# EasyEDA Pro project ProProject_Stc32f_Car副本_2024-06-03.epro, schematic schematic4_1
Create Date: 2024-03-14; Page Name: P1; Project Name: STC32F主板; Schematic Name: Schematic4; Update Date: 2024-04-30; Company: 嘉立创EDA; Page Size: A4; Version: V1.0
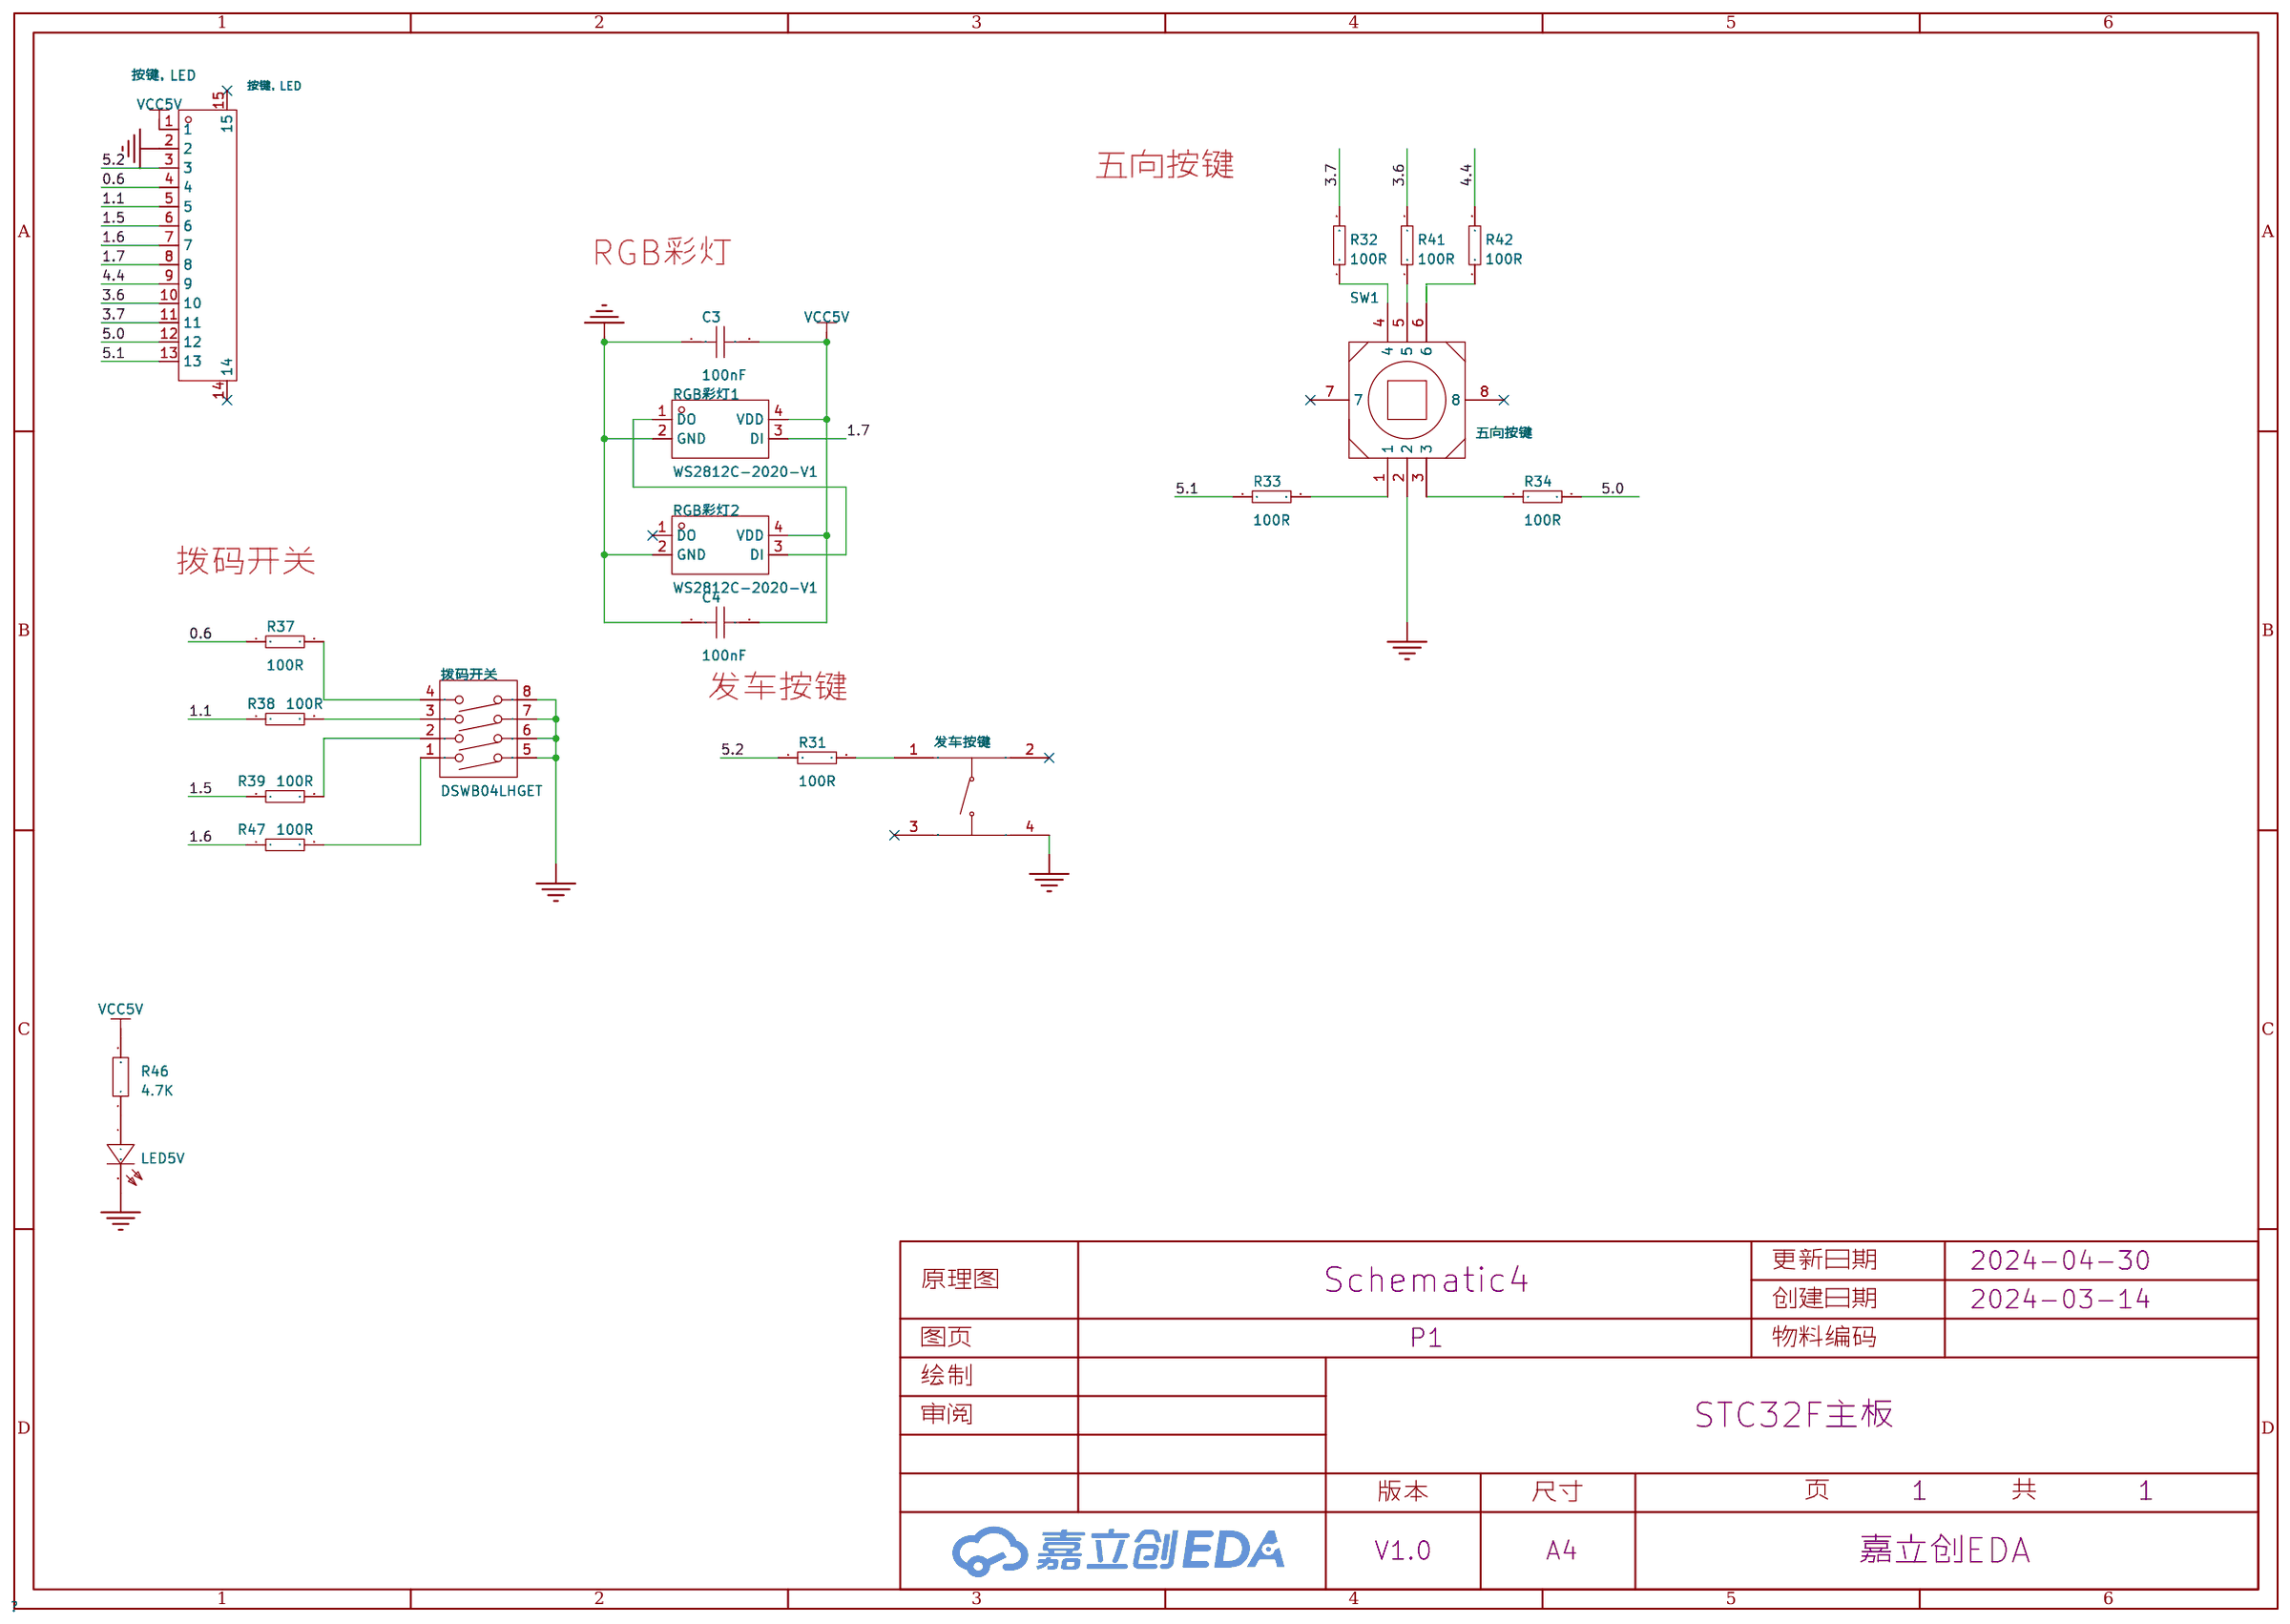
[diagram p2: schematic sheet]

## Parts
C3  100nF  [C0603]
C4  100nF  [C0603]
LED5V  翠绿贴片LED  [LEDC1608(0603)-L]
R31  100R  [RESC1608[0603]S-N]
R32  100R  [RESC1608[0603]S-N]
R33  100R  [RESC1608[0603]S-N]
R34  100R  [RESC1608[0603]S-N]
R37  100R  [RESC1608[0603]S-N]
R38  100R  [RESC1608[0603]S-N]
R39  100R  [RESC1608[0603]S-N]
R41  100R  [RESC1608[0603]S-N]
R42  100R  [RESC1608[0603]S-N]
R46  4.7K  [R0603]
R47  100R  [RESC1608[0603]S-N]
RGB彩灯1  WS2812C-2020-V1  [LED-SMD_4P-L2.0-W2.0-TL_WS2812B-2020]
RGB彩灯2  WS2812C-2020-V1  [LED-SMD_4P-L2.0-W2.0-TL_WS2812B-2020]
SW1  五向按键  [SW-SMD_GT-TC0060-H050-L1]
发车按键  TS3425PA 250gf 098  [SW-SMD_4P-L4.2-W3.4-P2.15-LS5.2]
拨码开关  DSWB04LHGET  [SW-TH_DSWB04LHGET]
按键，LED  按键，LED  [FPC-SMD_13P-P0.50_AFD01-S13FCA--00]

## Library data of the parts
C3 C4 = CAP_0603: Supplier Footprint: 0603
LED5V = LED Chip Green: Published: 8-Jun-2000; Revision: July-2002: Re-released for DXP Platform.; Publisher: Altium Limited; Price(RMB): 0.00; Origin Footprint 2: LEDC1608(0603); Origin Footprint 3: LEDC2012(0805); Origin Footprint 4: LEDC3216(1206); Origin Footprint 5: LEDC2012(0805)-L; Origin Footprint 6: LEDC3216(1204); Origin Footprint 7: LEDC3528-2
R31-R34 R37-R39 R41 R42 R47 = Res-Chip_9: Revision: V1.0; Power: 1/8W; Tolerance: ±1%; Origin Footprint 2: RESC0603[0201]-L; Origin Footprint 3: RESC0603[0201]-M; Origin Footprint 4: RESC0603[0201]-N; Origin Footprint 5: RESC0603[0201]S-L; Origin Footprint 6: RESC0603[0201]S-M; Origin Footprint 7: RESC0603[0201]S-N; Origin Footprint 8: RESC1005[0402]-L; Origin Footprint 9: RESC1005[0402]S-M; Origin Footprint 10: RESC1005[0402]-M; Origin Footprint 11: RESC1005[0402]-N; Origin Footprint 12: RESC1005[0402]S-L; Origin Footprint 13: RESC1005[0402]S-N; Origin Footprint 14: RESC1608[0603]-L; Origin Footprint 15: RESC1608[0603]-M; Origin Footprint 16: RESC1608[0603]-N; Origin Footprint 17: RESC1608[0603]S-L; Origin Footprint 18: RESC1608[0603]S-M; Origin Footprint 19: RESC2012[0805]; Origin Footprint 20: RESC2012[0805]S-L; Origin Footprint 21: RESC2012[0805]S-M; Origin Footprint 22: RESC2012[0805]S-N; Origin Footprint 23: RESC3216[1206]; Origin Footprint 24: RESC3216[1206]S-L; Origin Footprint 25: RESC3216[1206]S-M; Origin Footprint 26: RESC3216[1206]S-N; Origin Footprint 27: RESC3225[1210]; Origin Footprint 28: RESC3225[1210]S; Origin Footprint 29: RESC5025[2010]; Origin Footprint 30: RESC5025[2010]S; Origin Footprint 31: RESC6332[2512]; Origin Footprint 32: RESC6332[2512]S
R46 = Res_0603: Supplier Footprint: 0603
RGB彩灯1 RGB彩灯2 = WS2812C-2020-V1: 发光颜色:RGB三色;功率:-;正向电流:-;主波长:624nm；520nm；467nm;二极管配置:-;透镜颜色:-;色温:-;发光角度:-;载带方式:-;工作温度:-;; LCSC Part Name: RGB三色; Supplier Part: C2976072; Manufacturer: worldsemi; Supplier Footprint: SMD,2x2mm; JLCPCB Part Class: 扩展库; Datasheet: https://atta.szlcsc.com/upload/public/pdf/source/20220222/52A01000447F5320C9A8C3F34CEFDB81.pdf; Supplier: LCSC; Emitted Color: RGB三色; Dominant Wavelength: 624nm；520nm；467nm
SW1 = GT-TC0060-H050-L1: 开关长度:7.5mm;开关宽度:7.5mm;开关高度:5mm;机械寿命:-;; LCSC Part Name: 斜五向轻触开关 H5.0mm 无按压; Supplier Part: C3019726; Manufacturer: G-Switch(品赞); Supplier Footprint: SMD; JLCPCB Part Class: Extended Part; Datasheet: https://atta.szlcsc.com/upload/public/pdf/source/20220627/F366006EF64285B0201E3F28D953CABE.pdf; Supplier: LCSC; Switch Length: 7.5mm; Switch Width: 7.5mm; Switch Height: 5mm
发车按键 = TS3425PA 250gf 098: 电路结构:单刀单掷;按钮形状:椭圆形按钮;作用力:160gf;安装方式:立贴;开关长度:4mm;开关宽度:3mm;开关高度:2.5mm;带支架:不带;触点电流:50mA;额定电压(DC):12V;额定功率:0.6W;绝缘电阻:100MΩ;带灯:无;机械寿命:10万次;; LCSC Part Name: 电子烟轻触开关3*4*2.5mm 平脚3.4*4.2*2.5mm  250gf; Supplier Part: C5363474; Manufacturer: SHOU HAN(首韩); Supplier Footprint: SMD; JLCPCB Part Class: 扩展库; Datasheet: https://atta.szlcsc.com/upload/public/pdf/source/20230224/8E2DED868FB52CBA25EDBDE418AA439A.pdf; Supplier: LCSC; Circuit: 单刀单掷; Actuator Style: 椭圆形按钮; Operating Force: 160gf; Mounting Style: 立贴; Switch Length: 4mm; Switch Width: 3mm; Switch Height: 2.5mm; Strike Gundam: 不带; Contact Current: 50mA; Voltage Rating (DC): 12V; Power Rating: 0.6W; Insulation Resistance: 100MΩ; Actuator/Cap Color: 白色; With Lamp: 无; Mechanical Life: 10万次; Operating Temperature: -20℃~+80℃
拨码开关 = DSWB04LHGET: 类型:平拨,凸起式;电路结构:单刀单掷;开关位数:4位;使用寿命:-;颜色:红色;; LCSC Part Name: 间距2.54mm 平拨,凸起式 4位拨码开关; Supplier Part: C99418; Manufacturer: YE; Supplier Footprint: 插件; JLCPCB Part Class: 扩展库; Datasheet: https://atta.szlcsc.com/upload/public/pdf/source/20220830/02827E67A8727938D957A3CE4C86C92D.pdf; Supplier: LCSC; Type: 平拨,凸起式; Circuit: 单刀单掷; Number of Positions: 4位; Lead Pitch: 2.54mm; Color: 红色
按键，LED = AFD01-S13FCC-00: 锁定特性:翻盖式;触点类型:下接;触点数量:13P;间距:0.5mm;安装类型:卧贴;; LCSC Part Name: 间距:0.5mm P数:13P 翻盖式 下接; Supplier Part: C18198486; Manufacturer: JS(钜硕电子); Supplier Footprint: SMD,P=0.5mm,卧贴; Datasheet: https://atta.szlcsc.com/upload/public/pdf/source/20230921/C984413AEFF3A883511B509B58F9A1F7.pdf; Supplier: LCSC; Locking Feature: 翻盖式; Contact Type: 下接; Number of Contacts: 13P; Pitch: 0.5mm; Mounting Type: 卧贴; Height Above Board: 2mm

## Nets
GND: C3.1 C4.1 LED5V.C RGB彩灯1.2(GND) RGB彩灯2.2(GND) SW1.2 发车按键.4 拨码开关.5 拨码开关.6 拨码开关.7 拨码开关.8 按键，LED.2
VCC5V: C3.2 C4.2 R46.2 RGB彩灯1.4(VDD) RGB彩灯2.4(VDD) 按键，LED.1
0.6: R37.1 按键，LED.4
1.1: R38.1 按键，LED.5
1.5: R39.1 按键，LED.6
1.6: R47.1 按键，LED.7
1.7: RGB彩灯1.3(DI) 按键，LED.8
3.6: R41.2 按键，LED.10
3.7: R32.2 按键，LED.11
4.4: R42.2 按键，LED.9
5.0: R34.2 按键，LED.12
5.1: R33.1 按键，LED.13
5.2: R31.1 按键，LED.3
$1N1432: R37.2 拨码开关.4
$1N1433: R38.2 拨码开关.3
$1N1435: R39.2 拨码开关.2
$1N3416: R31.2 发车按键.1
$1N3923: LED5V.A R46.1
$1N8810: R47.2 拨码开关.1
$1N9803: RGB彩灯1.1(DO) RGB彩灯2.3(DI)
Net-(R32-1): R32.1 SW1.4
Net-(R33-2): R33.2 SW1.1
Net-(R34-1): R34.1 SW1.3
Net-(R41-1): R41.1 SW1.5
Net-(R42-1): R42.1 SW1.6

Not connected (* = marked no-connect by the designer): RGB彩灯2 1(DO)*; SW1 7* 8*; 发车按键 2* 3*; 按键，LED 14* 15*

## Notes on the sheet
- 五向按键
- RGB彩灯
- 拨码开关
- 发车按键
